# Altium schematic sheet Drone-Schematic-v1.SchDoc
size A4
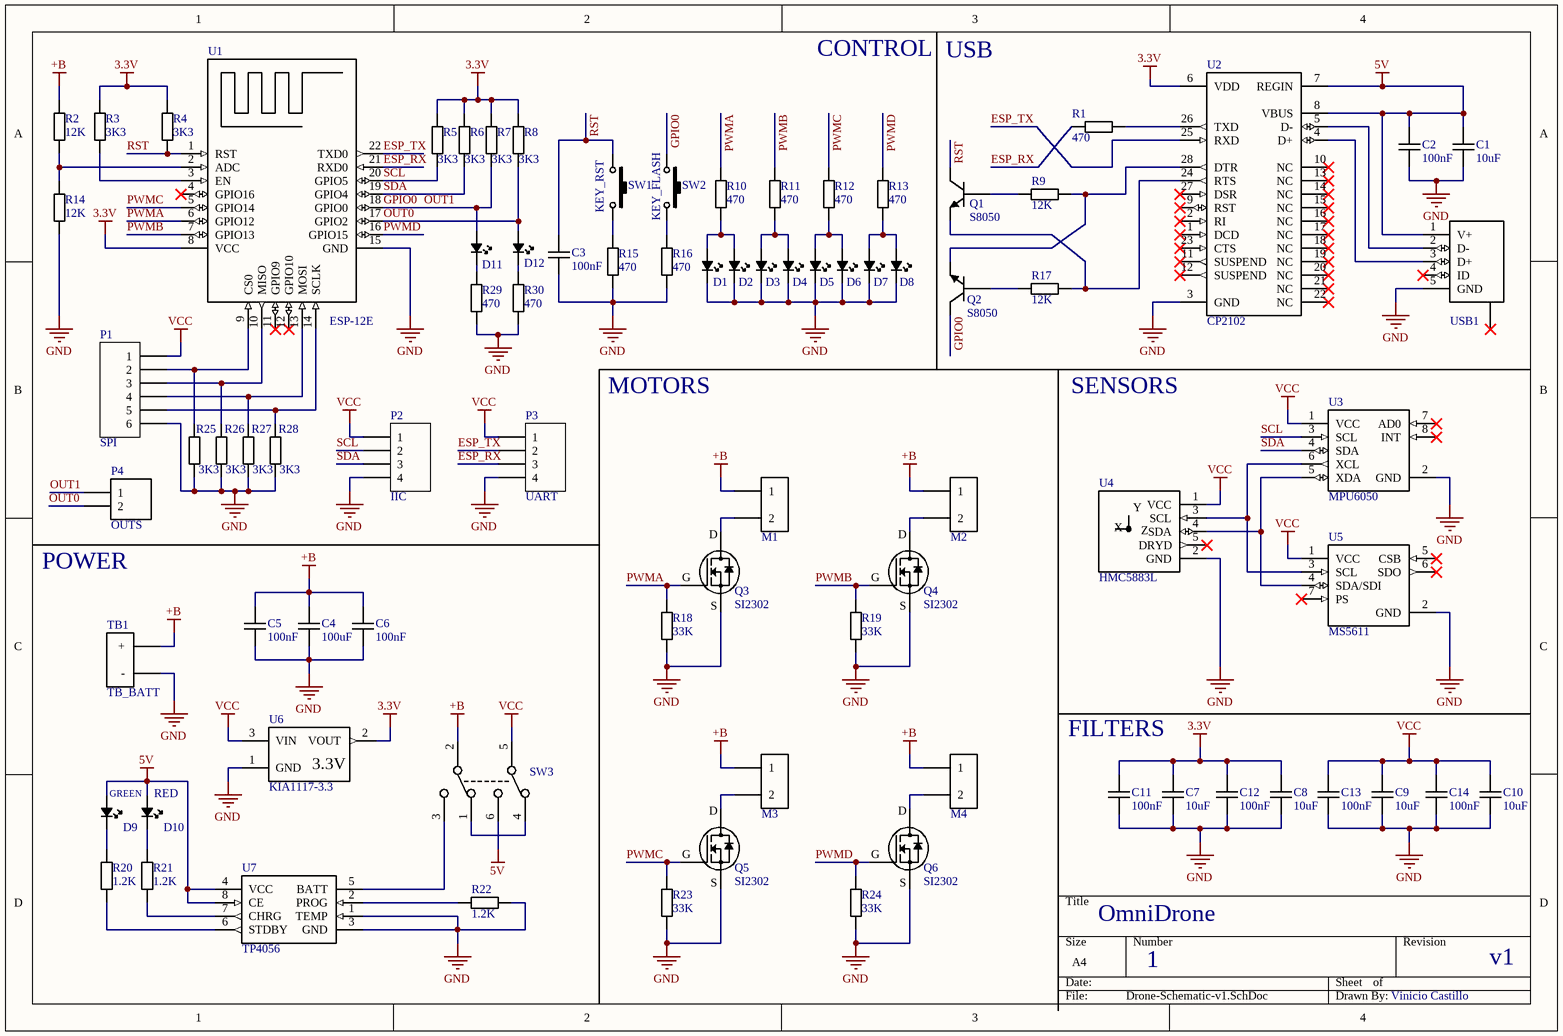
[diagram p0: Drone-Schematic-v1.SchDoc]

## Parts
C1  10uF  [1206CAP]
C2  100nF  [1206CAP]
C3  100nF  [1206CAP]
C4  100uF  [1206CAP]
C5  100nF  [1206CAP]
C6  100nF  [1206CAP]
C7  10uF  [1206CAP]
C8  10uF  [1206CAP]
C9  10uF  [1206CAP]
C10  10uF  [1206CAP]
C11  100nF  [1206CAP]
C12  100nF  [1206CAP]
C13  100nF  [1206CAP]
C14  100nF  [1206CAP]
D1  LED  [1206DIODE]  (value not drawn)
D2  LED  [1206DIODE]  (value not drawn)
D3  LED  [1206DIODE]  (value not drawn)
D4  LED  [1206DIODE]  (value not drawn)
D5  LED  [1206DIODE]  (value not drawn)
D6  LED  [1206DIODE]  (value not drawn)
D7  LED  [1206DIODE]  (value not drawn)
D8  LED  [1206DIODE]  (value not drawn)
D9  LED  [1206DIODE]  (value not drawn)
D10  LED  [1206DIODE]  (value not drawn)
D11  LED  [1206DIODE]  (value not drawn)
D12  LED  [1206DIODE]  (value not drawn)
M1  TBX2X1  [JST 1.25mm]  (value not drawn)
M2  TBX2X1  [JST 1.25mm]  (value not drawn)
M3  TBX2X1  [JST 1.25mm]  (value not drawn)
M4  TBX2X1  [JST 1.25mm]  (value not drawn)
P1  SPI  [HDR1X6]
P2  IIC  [HDR1X4]
P3  UART  [HDR1X4]
P4  OUTS  [HDR1X2]
Q1  S8050  [SOT-23(SOT-23-3)]
Q2  S8050  [SOT-23(SOT-23-3)]
Q3  SI2302  [SOT-23(SOT-23-3)]
Q4  SI2302  [SOT-23(SOT-23-3)]
Q5  SI2302  [SOT-23(SOT-23-3)]
Q6  SI2302  [SOT-23(SOT-23-3)]
R1  470  [1206RES]
R2  12K  [1206RES]
R3  3K3  [1206RES]
R4  3K3  [1206RES]
R5  3K3  [1206RES]
R6  3K3  [1206RES]
R7  3K3  [1206RES]
R8  3K3  [1206RES]
R9  12K  [1206RES]
R10  470  [1206RES]
R11  470  [1206RES]
R12  470  [1206RES]
R13  470  [1206RES]
R14  12K  [1206RES]
R15  470  [1206RES]
R16  470  [1206RES]
R17  12K  [1206RES]
R18  33K  [1206RES]
R19  33K  [1206RES]
R20  1.2K  [1206RES]
R21  1.2K  [1206RES]
R22  1.2K  [1206RES]
R23  33K  [1206RES]
R24  33K  [1206RES]
R25  3K3  [1206RES]
R26  3K3  [1206RES]
R27  3K3  [1206RES]
R28  3K3  [1206RES]
R29  470  [1206RES]
R30  470  [1206RES]
SW1  PUSH BUTTON  [Push Button]  (value not drawn)
SW2  PUSH BUTTON  [Push Button]  (value not drawn)
SW3  SW DPDT  [DPDT SW]  (value not drawn)
TB1  TB_BATT  [2P PH2.0mm Pitch]
U1  ESP-12E  [ESP-12E]
U2  CP2102  [CP2102]
U3  MPU6050  [MPU6050 - PCB MODULE]
U4  HMC5883L  [HMC5883L - PCB MODULE]
U5  MS5611  [MS5611 - PCB MODULE]
U6  KIA1117-3.3  [KIA1117-3.3]
U7  TP4056  [TP4056]
USB1  USB Connector  [USB micro Female]  (value not drawn)

## Nets
3.3V: C7.2 C8.2 C11.2 C12.2 R3.2 R4.2 R5.2 R6.2 R7.2 R8.2 U1.8(VCC) U2.6(VDD) U6.2(VOUT)
5V: C1.2 C2.2 D9.1 D10.1 SW3.6 U2.7(REGIN) U2.8(VBUS) U7.4(VCC) U7.8(CE) USB1.1(V+)
+B: C4.2 C5.2 C6.2 M1.1 M2.1 M3.1 M4.1 R2.1 SW3.2 TB1.1(+)
GND: C1.1 C2.1 C3.1 C4.1 C5.1 C6.1 C7.1 C8.1 C9.1 C10.1 C11.1 C12.1 C13.1 C14.1 D1.2 D2.2 D3.2 D4.2 D5.2 D6.2 D7.2 D8.2 P1.6 P2.4 P3.4 Q3.2(S) Q4.2(S) Q5.2(S) Q6.2(S) R14.2 R15.1 R16.1 R18.2 R19.2 R22.1 R23.2 R24.2 R25.1 R26.1 R27.1 R28.1 R29.2 R30.2 TB1.2(-) U1.15(GND) U2.3(GND) U3.2(GND) U4.2(GND) U5.2(GND) U6.1(GND) U7.1(TEMP) U7.3(GND) USB1.5(GND)
VCC: C9.2 C10.2 C13.2 C14.2 P1.1 P2.1 P3.1 SW3.5 U3.1(VCC) U4.1(VCC) U5.1(VCC) U6.3(VIN)
ESP_RX: P3.3 R1.2 U1.21(RXD0)
ESP_TX: P3.2 U1.22(TXD0) U2.25(RXD)
GPIO0: D11.1 P4.1 Q2.3(C) R7.1 SW2.1 U1.18(GPIO0)  [also labelled OUT1]
OUT0: D12.1 P4.2 R8.1 U1.17(GPIO2)
PWMA: Q3.1(G) R10.2 R18.1 U1.6(GPIO12)
PWMB: Q4.1(G) R11.2 R19.1 U1.7(GPIO13)
PWMC: Q5.1(G) R12.2 R23.1 U1.5(GPIO14)
PWMD: Q6.1(G) R13.2 R24.1 U1.16(GPIO15)
RST: C3.2 Q1.3(C) R4.1 SW1.1 U1.1(RST)
SCL: P2.2 R5.1 U1.20(GPIO5) U3.3(SCL)
SDA: P2.3 R6.1 U1.19(GPIO4) U3.4(SDA)
NetD1_1: D1.1 D2.1 R10.1
NetD3_1: D3.1 D4.1 R11.1
NetD5_1: D5.1 D6.1 R12.1
NetD7_1: D7.1 D8.1 R13.1
NetD9_2: D9.2 R20.1
NetD10_2: D10.2 R21.1
NetD11_2: D11.2 R29.1
NetD12_2: D12.2 R30.1
NetM1_2: M1.2 Q3.3(D)
NetM2_2: M2.2 Q4.3(D)
NetM3_2: M3.2 Q5.3(D)
NetM4_2: M4.2 Q6.3(D)
NetP1_2: P1.2 R25.2 U1.9(CS0)
NetP1_3: P1.3 R26.2 U1.10(MISO)
NetP1_4: P1.4 R27.2 U1.13(MOSI)
NetP1_5: P1.5 R28.2 U1.14(SCLK)
NetQ1_1: Q1.1(B) R9.2
NetQ1_2: Q1.2(E) R17.1 U2.24(RTS)
NetQ2_1: Q2.1(B) R17.2
NetQ2_2: Q2.2(E) R9.1 U2.28(DTR)
NetR1_1: R1.1 U2.26(TXD)
NetR2_2: R2.2 R14.1 U1.2(ADC)
NetR3_1: R3.1 U1.3(EN)
NetR15_2: R15.2 SW1.2
NetR16_2: R16.2 SW2.2
NetR20_2: R20.2 U7.6(STDBY)
NetR21_2: R21.2 U7.7(CHRG)
NetR22_2: R22.2 U7.2(PROG)
NetSW3_1: SW3.1 SW3.4
NetSW3_3: SW3.3 U7.5(BATT)
NetU2_4: U2.4(D+) USB1.3(D+)
NetU2_5: U2.5(D-) USB1.2(D-)
NetU3_5: U3.5(XDA) U4.4(SDA) U5.4(SDA/SDI)
NetU3_6: U3.6(XCL) U4.3(SCL) U5.3(SCL)

Not connected (* = marked no-connect by the designer): SW1 0; SW2 0; U1 4(GPIO16)* 11(GPIO9)* 12(GPIO10)*; U2 1(DCD)* 2(RI)* 9(RST)* 10(NC)* 11(SUSPEND)* 12(SUSPEND)* 13(NC)* 14(NC)* 15(NC)* 16(NC)* 17(NC)* 18(NC)* 19(NC)* 20(NC)* 21(NC)* 22(NC)* 23(CTS)* 27(DSR)*; U3 7(AD0)* 8(INT)*; U4 5(DRYD)*; U5 5(CSB)* 6(SDO)* 7(PS)*; USB1 0* 4(ID)*

## Notes on the sheet
- CONTROL
- USB
- (near SW1) KEY_RST
- (near SW2) KEY_FLASH
- MOTORS
- SENSORS
- (near P4) POWER
- FILTERS
- GREEN
- (near D10) RED
- OmniDrone
- 1
- v1
- Vinicio Castillo
- (in symbol HMC5883L) Y; X; Z
- (in symbol KIA1117-3.3) 3.3V

## Library data of the parts
C1-C14 = Capacitor
D1-D12 = LED: Ligth Emitting Diode (LED)
M1-M4 = TBX2X1: Terminal Block 2 pins, 1 row
P1 = Header 6: Header, 6-Pin; LatestRevisionDate: 17-Jul-2002; LatestRevisionNote: Re-released for DXP Platform.; Publisher: Altium Limited
P2 P3 = Header 4: Header, 4-Pin; LatestRevisionDate: 17-Jul-2002; LatestRevisionNote: Re-released for DXP Platform.; Publisher: Altium Limited
P4 = Header 2: Header, 2-Pin; LatestRevisionDate: 17-Jul-2002; LatestRevisionNote: Re-released for DXP Platform.; Publisher: Altium Limited
Q1 Q2 = S8050: Transistor NPN 500mA 25V SOT-23(SOT-23-3) RoHS
Q3-Q6 = SI2302: MOSFET N Trench 20V 2.1A 1.2V @ 50uA 72 mO @ 3.6A,4.5V SOT-23(SOT-23-3) RoHS
R1-R30 = Resistor: Passive component
SW1 SW2 = PUSH BUTTON: Normally Open (NO) button
SW3 = SW DPDT: DPDT Switch
TB1 = TB_BATT: Battery terminal block
U1 = ESP-12E: ESP8266 MCU based WIFI PCB Module
U2 = CP2102: USB to UART interface IC 3.3v
U3 = MPU6050: PCB Module, 3 Axis Analog Gyro Sensors+ 3 Axis Accelerometer, IIC
U4 = HMC5883L: PCB Module, Triple Axis Compass Magnetometer Sensor Module, IIC Conn
U5 = MS5611: PCB Module, Atmospheric Pressure Sensor Module Meter Altimeter Sensor Module, IIC
U6 = KIA1117-3.3: LOD and Fixed positive voltage regulator 3.3V 1A
U7 = TP4056: 1A Standalone Linear Li-lon Battery Charger with Thermal  Regulation in SOP-8
USB1 = USB